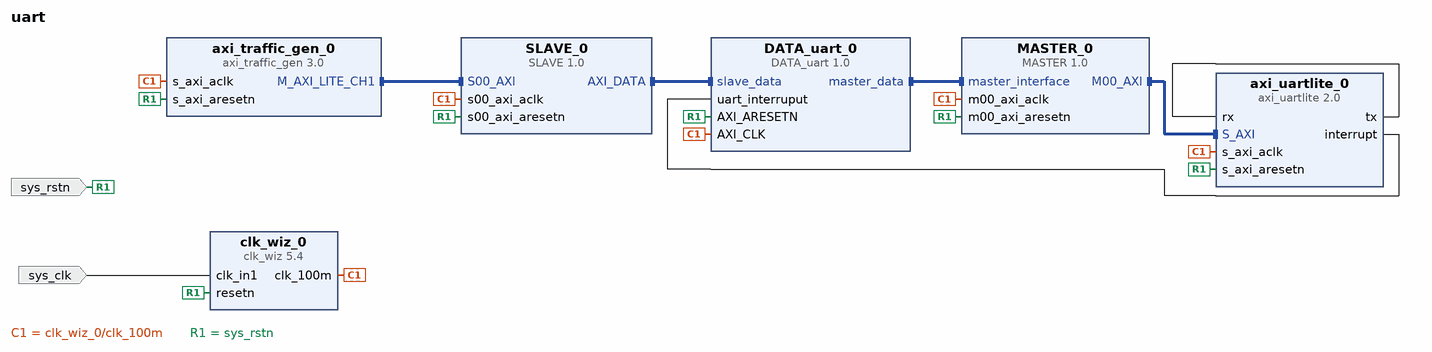
[diagram p0: block diagram of the top level]
# Vivado block design uart, xc7a200tfbg484-2, Vivado 2017.4
create_bd_design uart

create_bd_port -dir I -type rst sys_rstn
create_bd_port -dir I -type clk sys_clk

create_bd_cell -type ip -vlnv xilinx.com:ip:axi_traffic_gen:3.0 axi_traffic_gen_0
set_property -dict [list \
  CONFIG.C_ATG_SYSTEM_CMD_MAX_RETRY 500 \
  CONFIG.C_ATG_SYSTEM_INIT_DATA_MIF ../../../../../../../axi-traffic-gen-master/data.coe \
  CONFIG.C_ATG_SYSTEM_INIT_ADDR_MIF ../../../../../../../axi-traffic-gen-master/addr.coe \
  CONFIG.C_ATG_SYSTEM_INIT_MASK_MIF ../../../../../../../axi-traffic-gen-master/mask.coe \
  CONFIG.C_ATG_SYSTEM_INIT_CTRL_MIF ../../../../../../../axi-traffic-gen-master/ctrl.coe \
  CONFIG.C_ATG_MODE AXI4-Lite \
  CONFIG.C_ATG_SYSINIT_MODES System_Test \
] [get_bd_cells axi_traffic_gen_0]
create_bd_cell -type ip -vlnv wings:user:MASTER:1.0 MASTER_0
create_bd_cell -type ip -vlnv wings:user:SLAVE:1.0 SLAVE_0
create_bd_cell -type ip -vlnv xilinx.com:user:DATA_uart:1.0 DATA_uart_0
create_bd_cell -type ip -vlnv xilinx.com:ip:clk_wiz:5.4 clk_wiz_0
set_property -dict {CONFIG.CLK_OUT1_PORT clk_100m CONFIG.RESET_PORT resetn CONFIG.RESET_TYPE ACTIVE_LOW} [get_bd_cells clk_wiz_0]
create_bd_cell -type ip -vlnv xilinx.com:ip:axi_uartlite:2.0 axi_uartlite_0

# ---- connections ----

connect_bd_intf_net [get_bd_intf_pins axi_traffic_gen_0/M_AXI_LITE_CH1] [get_bd_intf_pins SLAVE_0/S00_AXI]
connect_bd_intf_net [get_bd_intf_pins SLAVE_0/AXI_DATA] [get_bd_intf_pins DATA_uart_0/slave_data]
connect_bd_intf_net [get_bd_intf_pins DATA_uart_0/master_data] [get_bd_intf_pins MASTER_0/master_interface]
connect_bd_intf_net [get_bd_intf_pins MASTER_0/M00_AXI] [get_bd_intf_pins axi_uartlite_0/S_AXI]
connect_bd_net [get_bd_pins axi_uartlite_0/tx] [get_bd_pins axi_uartlite_0/rx]
connect_bd_net [get_bd_pins axi_uartlite_0/interrupt] [get_bd_pins DATA_uart_0/uart_interruput]
connect_bd_net [get_bd_pins clk_wiz_0/clk_100m] \
  [get_bd_pins axi_traffic_gen_0/s_axi_aclk] [get_bd_pins SLAVE_0/s00_axi_aclk] [get_bd_pins DATA_uart_0/AXI_CLK] \
  [get_bd_pins MASTER_0/m00_axi_aclk] [get_bd_pins axi_uartlite_0/s_axi_aclk]
connect_bd_net -net resetn_0_1 [get_bd_ports sys_rstn] \
  [get_bd_pins clk_wiz_0/resetn] [get_bd_pins axi_uartlite_0/s_axi_aresetn] [get_bd_pins MASTER_0/m00_axi_aresetn] \
  [get_bd_pins DATA_uart_0/AXI_ARESETN] [get_bd_pins SLAVE_0/s00_axi_aresetn] [get_bd_pins axi_traffic_gen_0/s_axi_aresetn]
connect_bd_net -net clk_in1_0_1 [get_bd_ports sys_clk] [get_bd_pins clk_wiz_0/clk_in1]

# ---- address map ----
assign_bd_address -offset 0x44A00000 -range 64K -target_address_space [get_bd_addr_spaces axi_traffic_gen_0/Reg1] [get_bd_addr_segs SLAVE_0/S00_AXI/S00_AXI_reg]
assign_bd_address -offset 0x40600000 -range 64K -target_address_space [get_bd_addr_spaces MASTER_0/M00_AXI] [get_bd_addr_segs axi_uartlite_0/S_AXI/Reg]

validate_bd_design
save_bd_design
